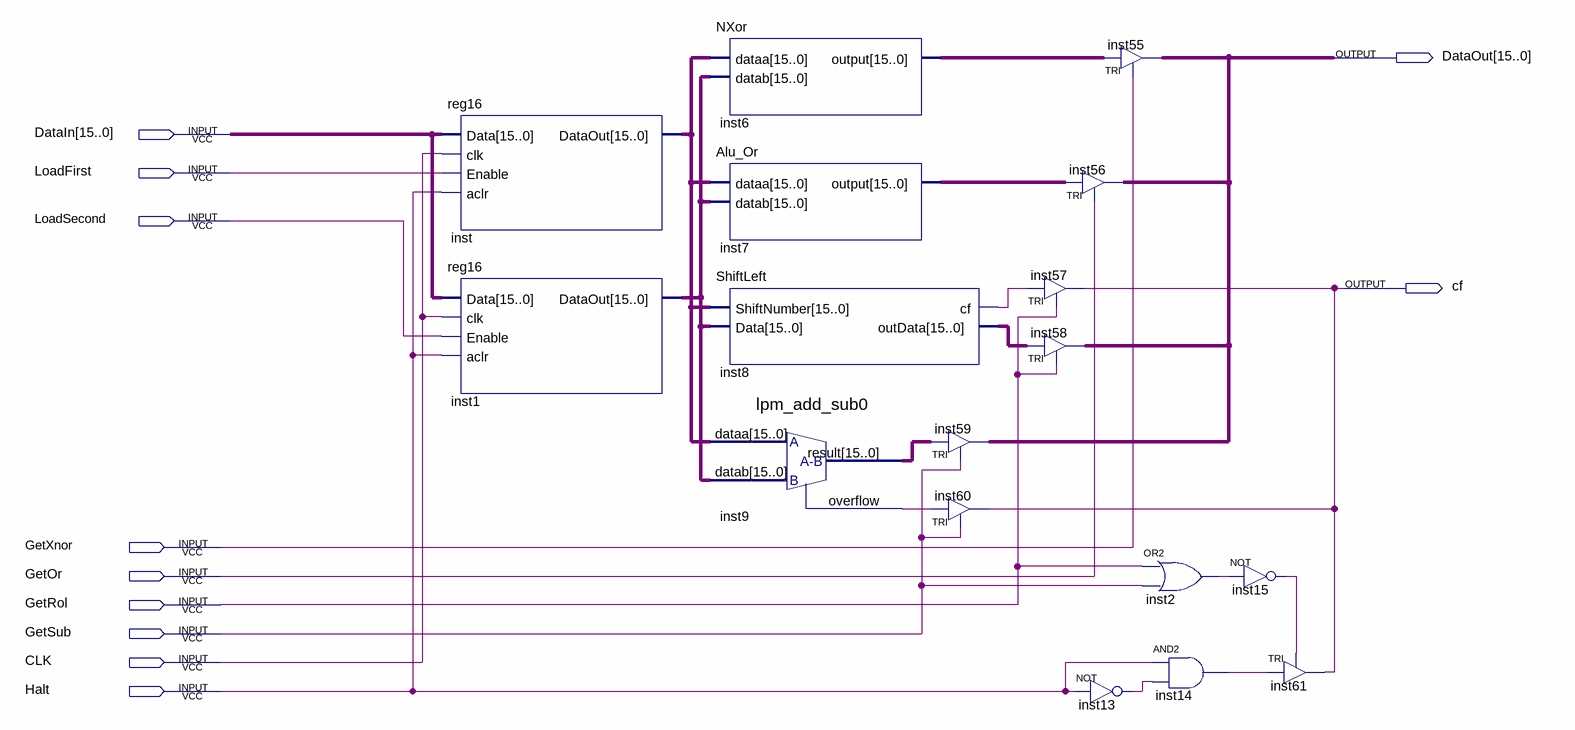
[diagram p0: schematic sheet]
// Quartus schematic ALU.bdf as structural Verilog: 17 symbols, 11 pins
module ALU (
  input  [15:0] DataIn,
  input  LoadFirst,
  input  LoadSecond,
  input  GetXnor,
  input  GetOr,
  input  GetRol,
  input  GetSub,
  input  CLK,
  input  Halt,
  output [15:0] DataOut,
  output cf
);

  wire inst2_out, inst8_cf, inst9_overflow, inst13_out, inst14_out, inst15_out;
  wire [15:0] inst1_dataout, inst6_output, inst7_output, inst8_outdata, inst9_result, inst_dataout;

  reg16 inst (.Data(DataIn), .clk(CLK), .Enable(LoadFirst), .aclr(Halt), .DataOut(inst_dataout));
  reg16 inst1 (.Data(DataIn), .clk(CLK), .Enable(LoadSecond), .aclr(Halt), .DataOut(inst1_dataout));
  NXor inst6 (.dataa(inst_dataout), .datab(inst1_dataout), .\output (inst6_output));
  Alu_Or inst7 (.dataa(inst_dataout), .datab(inst1_dataout), .\output (inst7_output));
  ShiftLeft inst8 (.ShiftNumber(inst_dataout), .Data(inst1_dataout), .cf(inst8_cf), .outData(inst8_outdata));
  lpm_add_sub0 inst9 (.dataa(inst_dataout), .datab(inst1_dataout), .result(inst9_result), .overflow(inst9_overflow));
  TRI inst59[15:0] (.IN(inst9_result), .OE(GetSub), .OUT(DataOut));
  TRI inst60 (.IN(inst9_overflow), .OE(GetSub), .OUT(cf));
  TRI inst56[15:0] (.IN(inst7_output), .OE(GetOr), .OUT(DataOut));
  TRI inst57 (.IN(inst8_cf), .OE(GetRol), .OUT(cf));
  TRI inst58[15:0] (.IN(inst8_outdata), .OE(GetRol), .OUT(DataOut));
  not inst13 (inst13_out, Halt);
  TRI inst55[15:0] (.IN(inst6_output), .OE(GetXnor), .OUT(DataOut));
  or inst2 (inst2_out, GetRol, GetSub);
  and inst14 (inst14_out, Halt, inst13_out);
  not inst15 (inst15_out, inst2_out);
  TRI inst61 (.IN(inst14_out), .OE(inst15_out), .OUT(cf));
endmodule
